# EAGLE design STM_L5970D_1A0 (EAGLE 7.5.0)
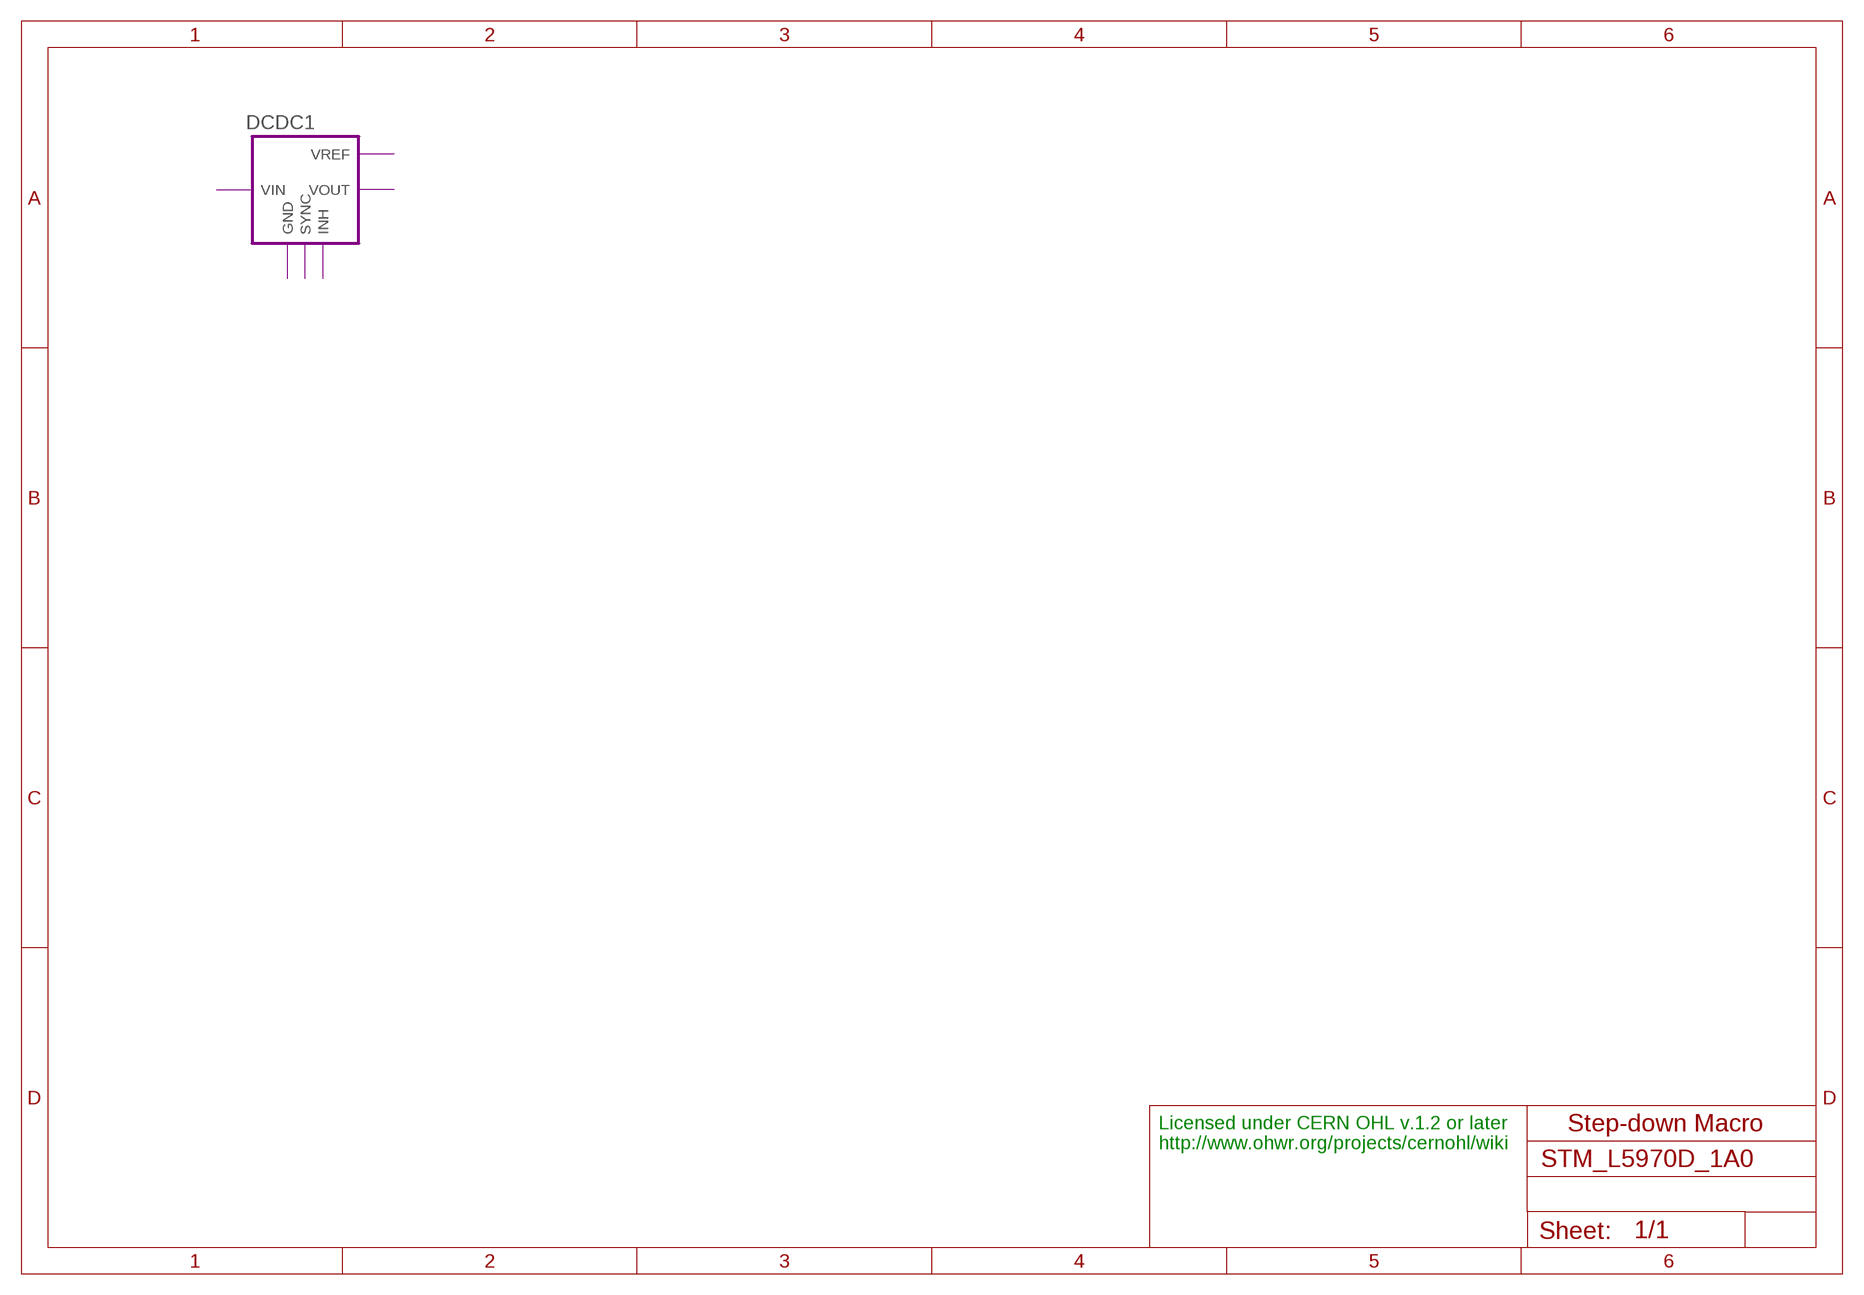
[diagram p0: schematic, sheet 1]

## Module instances
DCDC1 = STM_L5970D_1A0

## Notes on the sheet
- Step-down Macro
- Licensed under CERN OHL v.1.2 or later
  http://www.ohwr.org/projects/cernohl/wiki

## Library data of the parts

## Module STM_L5970D_1A0
Ports: VIN(pwr) GND(pwr) VOUT(out) SYNC(io) VREF(out) INH(io)
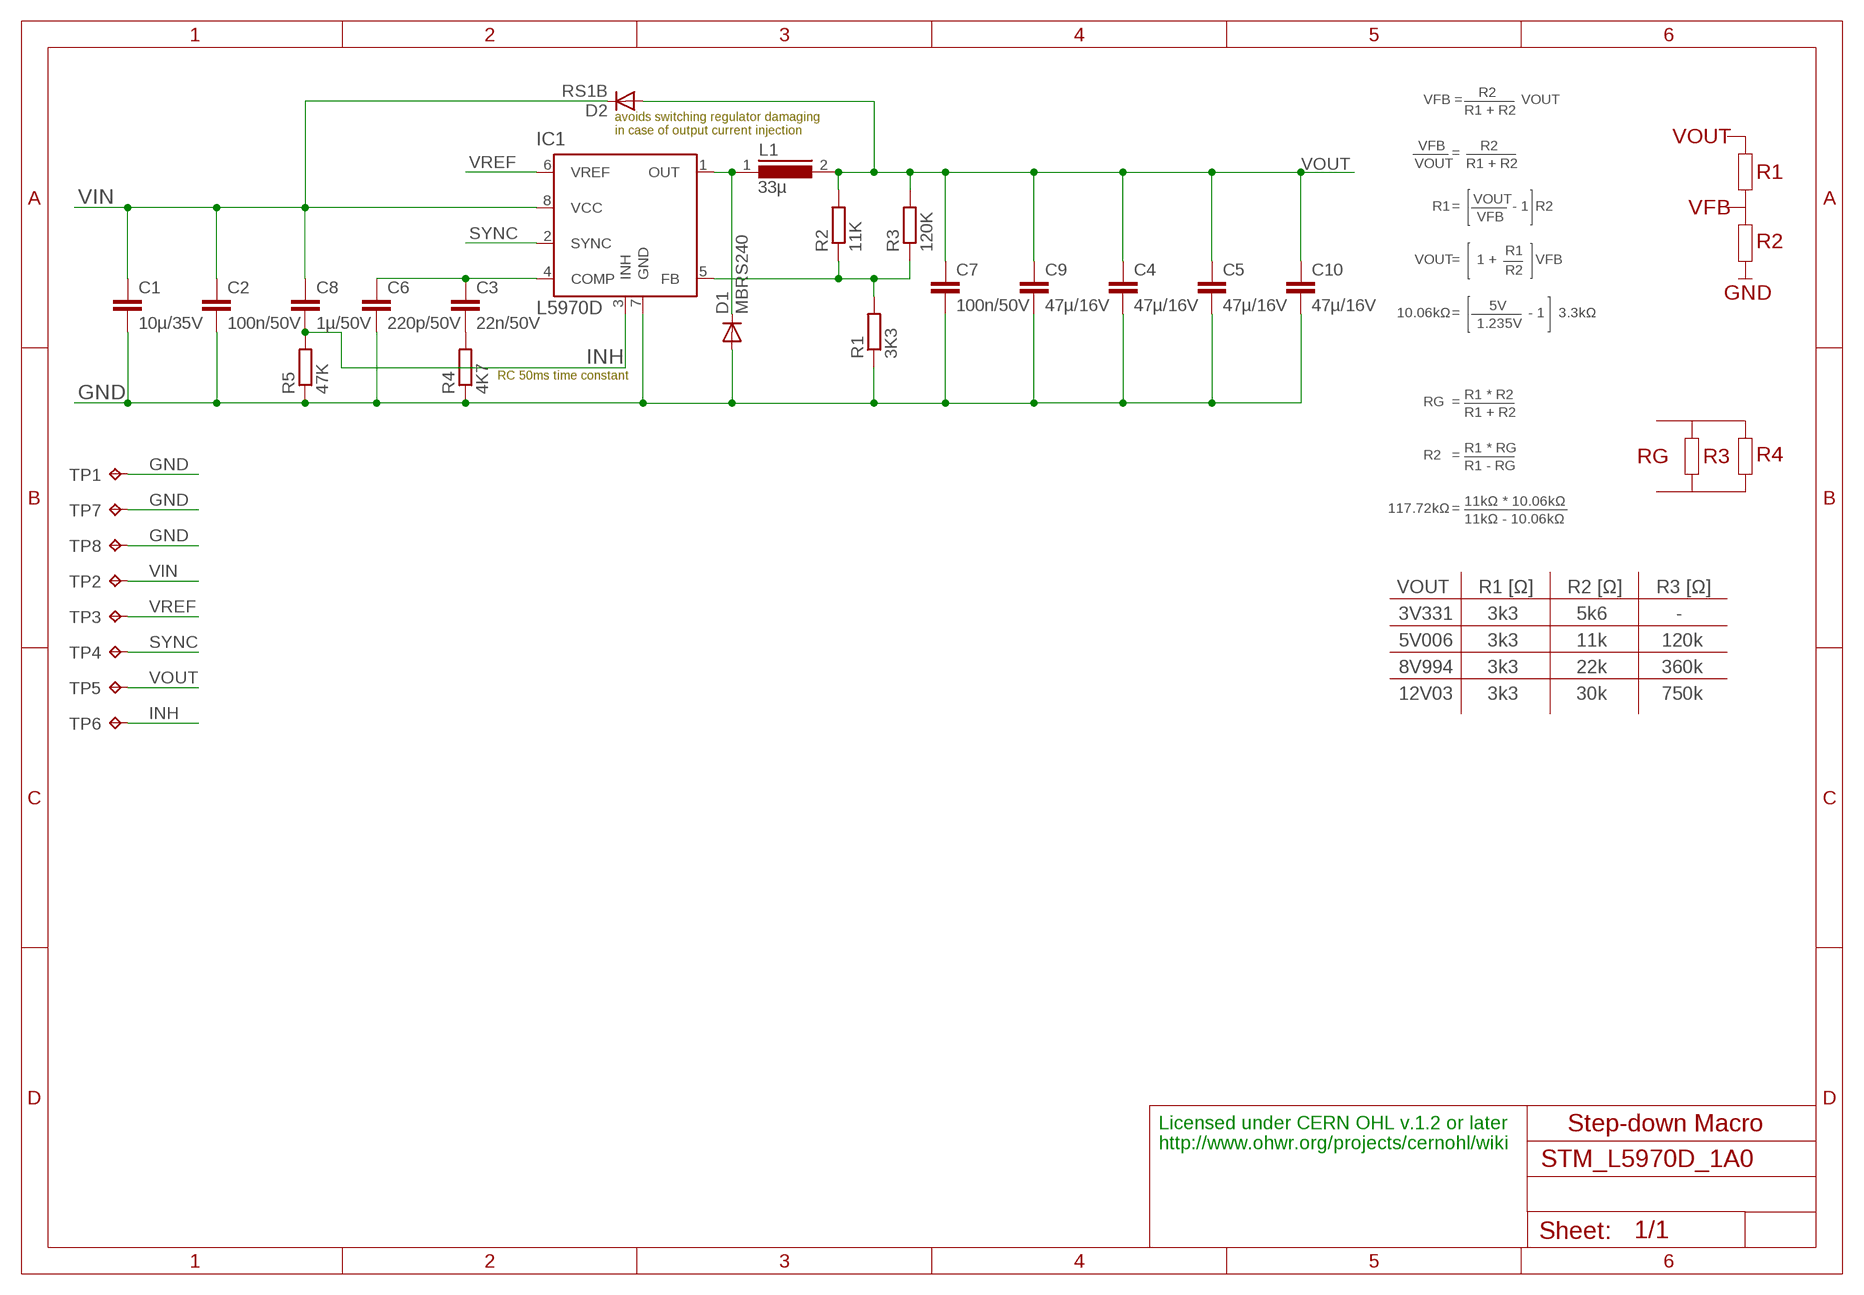
[diagram p1: schematic, module STM_L5970D_1A0, sheet 1]

### Parts
C1  10µ/35V  X7R-10000000P-1210  [1210]
C2  100n/50V  X7R-100000P-1206  [1206]
C3  22n/50V  X7R-22000P-1206  [1206]
C4  47µ/16V  X5R-47000000P-1210  [1210]
C5  47µ/16V  X5R-47000000P-1210  [1210]
C6  220p/50V  NP0-220P-1206  [1206]
C7  100n/50V  X7R-100000P-1206  [1206]
C8  1µ/50V  X7R-1000000P-1206  [1206]
C9  47µ/16V  X5R-47000000P-1210  [1210]
C10  47µ/16V  X5R-47000000P-1210  [1210]
D1  MBRS240  [DO214AA]
D2  RS1B  [DO214AC]
IC1  L5970D  [SOIC08]
L1  33µ  PISM-330X  [PISM]
R1  3K3  RC1206-3300  [1206]
R2  11K  RC1206-11000  [1206]  (variant 3V3: 5K6)  (variant 9V0: 22K)  (variant 12V0: 30K)
R3  120K  RC1206-120000  [1206]  (not fitted in variant 3V3)  (variant 9V0: 360K)  (variant 12V0: 750K)
R4  4K7  RC1206-4700  [1206]
R5  47K  RC1206-47000  [1206]
TP1  TPB1,27  [B1,27]
TP2  TPB1,27  [B1,27]
TP3  TPB1,27  [B1,27]
TP4  TPB1,27  [B1,27]
TP5  TPB1,27  [B1,27]
TP6  TPB1,27  [B1,27]
TP7  TPB1,27  [B1,27]
TP8  TPB1,27  [B1,27]

### Nets
GND: C1.2 C2.2 C4.2 C5.2 C6.2 C7.2 C9.2 C10.2 D1.A IC1.7(GND) R1.1 R4.1 R5.1 TP1.TP TP7.TP TP8.TP
INH: C8.2 IC1.3(INH) R5.2 TP6.TP
N$1: D1.C IC1.1(OUT) L1.1
N$2: IC1.5(FB) R1.2 R2.1 R3.1
N$3: C3.1 C6.1 IC1.4(COMP)
N$4: C3.2 R4.2
SYNC: IC1.2(SYNC) TP4.TP
VIN: C1.1 C2.1 C8.1 D2.C IC1.8(VCC) TP2.TP
VOUT: C4.1 C5.1 C7.1 C9.1 C10.1 D2.A L1.2 R2.2 R3.2 TP5.TP
VREF: IC1.6(VREF) TP3.TP

### Notes on the sheet
- R2
- VFB = | VOUT
- R1 + R2
- avoids switching regulator damaging
  in case of output current injection
- VOUT
- VFB | R2
- =
- VOUT | R1 + R2
- R1
- VOUT
- R1 | = | - 1 | R2 | VFB
- VFB
- R2
- R1
- VOUT | = | 1 + | VFB
- R2
- GND
- 5V
- 10.06kΩ | = | - 1 | 3.3kΩ
- 1.235V
- RC 50ms time constant
- R1 * R2
- RG | =
- R1 + R2
- R1 * RG
- R2 | = | RG | R3 | R4
- R1 - RG
- 11kΩ * 10.06kΩ
- 117.72kΩ | =
- 11kΩ - 10.06kΩ
- VOUT | R1 [Ω] | R2 [Ω] | R3 [Ω]
- 3V331 | 3k3 | 5k6 | -
- 5V006 | 3k3 | 11k | 120k
- 8V994 | 3k3 | 22k | 360k
- 12V03 | 3k3 | 30k | 750k
- Step-down Macro
- Licensed under CERN OHL v.1.2 or later
  http://www.ohwr.org/projects/cernohl/wiki

### Library data of the parts
C1 = omcCapacitor:X7R: X7R Ceramic Capacitors YAGEO Multilayer Capacitors For General Purpose Temperature characteristics: X7R Rated Voltage: 50V Operating Temperature Range: –55°C to +125°C Reichelt Datasheet <http://cdn-reichelt.de/documents/datenblatt/B300/X7R.pdf> MURATA GCM Series High Dielectric Constant Type Murata Datasheet <http://www.murata.com/~/media/webrenewal/support/library/catalog/products/capacitor/mlcc/c03e.ashx> Reichelt Datasheet <http://cdn-reichelt.de/documents/datenblatt/A900/DATASHEET_SMD_0805_1206_1210.pdf>; DIST#REICHELT#: X7R-G1210 10; VENDOR#: MURATA#GCM32EC7YA106KA03
C2 C7 = omcCapacitor:X7R: X7R Ceramic Capacitors YAGEO Multilayer Capacitors For General Purpose Temperature characteristics: X7R Rated Voltage: 50V Operating Temperature Range: –55°C to +125°C Reichelt Datasheet <http://cdn-reichelt.de/documents/datenblatt/B300/X7R.pdf> MURATA GCM Series High Dielectric Constant Type Murata Datasheet <http://www.murata.com/~/media/webrenewal/support/library/catalog/products/capacitor/mlcc/c03e.ashx> Reichelt Datasheet <http://cdn-reichelt.de/documents/datenblatt/A900/DATASHEET_SMD_0805_1206_1210.pdf>; DIST#REICHELT#: X7R-G1206 100N; VENDOR#: YAGEO#12062R104K9BP0D
C3 = omcCapacitor:X7R: X7R Ceramic Capacitors YAGEO Multilayer Capacitors For General Purpose Temperature characteristics: X7R Rated Voltage: 50V Operating Temperature Range: –55°C to +125°C Reichelt Datasheet <http://cdn-reichelt.de/documents/datenblatt/B300/X7R.pdf> MURATA GCM Series High Dielectric Constant Type Murata Datasheet <http://www.murata.com/~/media/webrenewal/support/library/catalog/products/capacitor/mlcc/c03e.ashx> Reichelt Datasheet <http://cdn-reichelt.de/documents/datenblatt/A900/DATASHEET_SMD_0805_1206_1210.pdf>; DIST#REICHELT#: X7R-G1206 22N; VENDOR#: YAGEO#12062R223K9BP0D
C4 C5 C9 C10 = omcCapacitor:X5R: X5R Ceramic Capacitors Murate GRM Series For General Purpose Temperature characteristics: X5R Size: 0.4×0.2mm to 5.7×5.0mm Rated Voltage: DC2.5V to 3.15kV Operating Temperature Range: –55°C to +85°C Product Side <http://psearch.en.murata.com/capacitor/lineup/grm> Murata Datasheet <http://www.murata.com/~/media/webrenewal/support/library/catalog/products/capacitor/mlcc/c02e.ashx> Distributor Reichelt: avialable Conrad: avialable Digi-Key: -; DIST#REICHELT#: X5R-G1210 47; VENDOR#: MURATA,GRM32ER61C476ME15#
C6 = omcCapacitor:NP0: NP0 Surface-Mount Ceramic Multilayer Capacitors YAGEO Multilayer Capacitors For General Purpose RoHS compliant Rated Voltage: 50V Operating Temperature Range: –55°C to +125°C Yageo Datasheet <http://www.yageo.com/documents/recent/UPY-GP_NP0_16V-to-50V_8.pdf> Distributor Reichelt: avialable Conrad: avialable Digi-Key: -; DIST#REICHELT#: NPO-G1206 220P; VENDOR#: YAGEO#1206CG221J9BP
C8 = omcCapacitor:X7R: X7R Ceramic Capacitors YAGEO Multilayer Capacitors For General Purpose Temperature characteristics: X7R Rated Voltage: 50V Operating Temperature Range: –55°C to +125°C Reichelt Datasheet <http://cdn-reichelt.de/documents/datenblatt/B300/X7R.pdf> MURATA GCM Series High Dielectric Constant Type Murata Datasheet <http://www.murata.com/~/media/webrenewal/support/library/catalog/products/capacitor/mlcc/c03e.ashx> Reichelt Datasheet <http://cdn-reichelt.de/documents/datenblatt/A900/DATASHEET_SMD_0805_1206_1210.pdf>; DIST#REICHELT#: X7R-G1206 1,0/50; VENDOR#: MURATA#GCM31MR71H105KA55
D1 = omcDiode:MBRS2: MBRS2X0 - 2A Schottky Power Rectifier Schottky barrier rectifiers 2A 40V SMB 403A-03 (DO213AB) Package Fairchild MBRS320 Datasheet <https://www.fairchildsemi.com/datasheets/MB/MBRS320.pdf> Reichelt Datasheet <http://cdn-reichelt.de/documents/datenblatt/A400/MBRS240SMD_ONS.pdf> Characteristics MBRS240 Unit Peak Repetitive Reverse Voltage 40 V Average Rectified Forward Current 2.0 @100°C A Nonrepetitive Peak Surge Current 25 A Operating Junction Temperature – 55 to +150 °C Thermal Resistance — Junction to Lead 18 °C/W Maximum Instantaneous Forward Voltage (IF = 3.0 A, TJ = 25°C)) 0.43 V Maximum Instantaneous Reverse Current Rated dc Voltage, TJ = 25°C Rated dc Voltage, TJ = 100°C 2.0 60 mA Distributor Reichelt: avialable Conrad: ? Digi-Key: ?; DIST#REICHELT#: MBRS 240 SMD; VENDOR#: On Semiconductor,MBRS240LT3G
D2 = omcDiode:RS1: RS1X - PN Diode For surface mounted application Glass passivated junction chip Built-in strain relief, ideal for automated placement Fast switching for high efficiency Plastic material used carries Underwriters Laboratory Classification 94V-O High temperature soldering: 260°C/10sec at terminals Taiwan Semiconductor Datasheet <http://www.taiwansemi.com/products/datasheet/RS1A%20SERIES_K15.pdf> Reichelt Datasheet <http://cdn-reichelt.de/documents/datenblatt/A400/RS1-TSC.pdf> Maximum Ratings and Electrical Characteristics Type Number Symbol RS1A RS1B RS1D RS1G RS1J RS1K RS1M Unit Maximum Repetitive Peak Reverse Voltage VRRM 50 100 200 400 600 800 100 V Maximum RMS Voltage VRMS 35 70 140 280 420 560 700 V Maximum DC Blocking Voltage VDC 50 100 200 400 600 800 1000 V Maximum Average Forward Rectified Current .375 (9.5mm) Lead Length @ TL=90℃ IF(AV) 1 A Peak Forward Surge Current, 8.3 ms Single Half Sine- waveSuperimposed on Rated Load (JEDEC method) IFSM 30 A Maximum Instantaneous Forward Voltage @ 1A VF 1.3 V Maximum Reverse Current @ Rated VR TA=25 ℃ TA=125 ℃ IR 5 50 µA Maximum Reverse Recovery Time Trr 150 250 500 nS Typical Junction Capacitance Cj 10 pF Typical Thermal Resistance RθjA RθjC 105 32 °C/W Operating Temperature Range TJ -55 to +150 °C Storage Temperature Range TSTG -55 to +150 °C Distributor Reichelt: avialable Conrad: avialable Digi-Key: -; DIST#REICHET#: RS 1B; VENDOR#: Taiwan Semiconductor,RS1BHR3G
IC1 = omcPwrSupply:L5970D: STMicroelectronics - L5970D - Up to 1A step down switching regulator Up to 1A output current Operating input voltage from 4.4V to 36V 3.3V / (±2%) reference voltage Output voltage adjustable from 1.2V to 35V Low dropout operation: 100% duty cycle 250KHz Internally fixed frequency Voltage feedforward Zero load current operation Internal current limiting Inhibit for zero current consumption Synchronization Protection against feedback disconnection Thermal shutdown STM Datasheet <http://www.st.com/web/en/resource/technical/document/datasheet/CD00002173.pdf> Reichelt Datasheet <http://cdn-reichelt.de/documents/datenblatt/A200/DS_5970D.pdf>; DIST#CONRAD#: 1185187 - 62; DIST#REICHELT#: L 5970 D; VENDOR#: STM,L5970D013TR
L1 = omcInductor:PISM: PISM - SMD Power Inductors Inductance: 1µH - 2200µH Current: 0.25A - 10A Mounting: SMD Material: Ferrite Dimension: L: 13mm W: 9.55mm H: 5.35mm Fastron Datasheet <http://www.fastrongroup.com/image-show/56/PISM.pdf?type=Complete-DataSheet&productType=series> Reichelt Datasheet <http://cdn-reichelt.de/documents/datenblatt/B400/PISM.pdf> Inductance L [µH] fL [MHz] SRFmin [MHz] DCRmax [Ω] Rated DC Current [A] Isat IΔT 1.0 0.1 115 0.008 10 6.9 1.5 0.1 90 0.009 9 6.5 2.2 0.1 80 0.010 8 6.2 3.3 0.1 58 0.014 7 5.5 4.7 0.1 49 0.017 6 4.9 6.8 0.1 39 0.022 5.1 4.4 10 0.1 28 0.036 4.2 3.9 15 0.1 22 0.050 3.2 3.2 22 0.1 17 0.060 2.7 2.7 33 0.1 13 0.100 2.1 2.1 47 0.1 10 0.140 1.7 1.7 68 0.1 8.5 0.190 1.5 1.5 100 0.1 7.0 0.280 1.2 1.2 150 0.1 5.3 0.420 1.0 1.0 220 0.1 4.1 0.600 0.85 0.85 330 0.1 3.2 0.900 0.65 0.65 470 0.1 2.8 1.250 0.55 0.55 680 0.1 2.3 2.00 0.45 0.45 1000 0.1 1.7 2.70 0.35 0.35 2200 0.1 1.4 7.00 0.25 0.22 Distributor Reichelt: L-PISM XXµ Conrad: avialable Digi-Key: -; DIST#REICHELT#: L-PISM 33µ; VENDOR#: Fastron,PISM-330X-04
R1 = omcResistor:RC1206: YAGEO RC1206 - General Purpose Chip Resistors Power dissipation: 0.250W 1% Tolerance E96 Series Operating Temperature Range: –55°C to +155°C Maximum Working Voltage: 200V Maximum Overload Voltage: 400V Temperature Coefficient: 10Ω< R≤10MΩ: ±100 ppm/°C R≤10Ω || R>10 MΩ: ±200 ppm/°C Jumper Criteria Rated Current: 2A Maximum Current: 10A Yageo Datasheet <http://www.yageo.ru/pdf/RC1206.pdf> Reichelt Datasheet <http://cdn-reichelt.de/documents/datenblatt/A900/SMD_1206.pdf> Distributor Reichelt: E24 Conrad: avialable Digi-Key: -; DIST#REICHELT#: SMD 1/4W 3,3K; VENDOR#: YAGEO#RC1206FR-073K3L
R2 = omcResistor:RC1206: YAGEO RC1206 - General Purpose Chip Resistors Power dissipation: 0.250W 1% Tolerance E96 Series Operating Temperature Range: –55°C to +155°C Maximum Working Voltage: 200V Maximum Overload Voltage: 400V Temperature Coefficient: 10Ω< R≤10MΩ: ±100 ppm/°C R≤10Ω || R>10 MΩ: ±200 ppm/°C Jumper Criteria Rated Current: 2A Maximum Current: 10A Yageo Datasheet <http://www.yageo.ru/pdf/RC1206.pdf> Reichelt Datasheet <http://cdn-reichelt.de/documents/datenblatt/A900/SMD_1206.pdf> Distributor Reichelt: E24 Conrad: avialable Digi-Key: -; DIST#REICHELT#: SMD 1/4W 11K; VENDOR#: YAGEO#RC1206FR-0711KL
R3 = omcResistor:RC1206: YAGEO RC1206 - General Purpose Chip Resistors Power dissipation: 0.250W 1% Tolerance E96 Series Operating Temperature Range: –55°C to +155°C Maximum Working Voltage: 200V Maximum Overload Voltage: 400V Temperature Coefficient: 10Ω< R≤10MΩ: ±100 ppm/°C R≤10Ω || R>10 MΩ: ±200 ppm/°C Jumper Criteria Rated Current: 2A Maximum Current: 10A Yageo Datasheet <http://www.yageo.ru/pdf/RC1206.pdf> Reichelt Datasheet <http://cdn-reichelt.de/documents/datenblatt/A900/SMD_1206.pdf> Distributor Reichelt: E24 Conrad: avialable Digi-Key: -; DIST#REICHELT#: SMD 1/4W 120K; VENDOR#: YAGEO#RC1206FR-07120KL
R4 = omcResistor:RC1206: YAGEO RC1206 - General Purpose Chip Resistors Power dissipation: 0.250W 1% Tolerance E96 Series Operating Temperature Range: –55°C to +155°C Maximum Working Voltage: 200V Maximum Overload Voltage: 400V Temperature Coefficient: 10Ω< R≤10MΩ: ±100 ppm/°C R≤10Ω || R>10 MΩ: ±200 ppm/°C Jumper Criteria Rated Current: 2A Maximum Current: 10A Yageo Datasheet <http://www.yageo.ru/pdf/RC1206.pdf> Reichelt Datasheet <http://cdn-reichelt.de/documents/datenblatt/A900/SMD_1206.pdf> Distributor Reichelt: E24 Conrad: avialable Digi-Key: -; DIST#REICHELT#: SMD 1/4W 4,7K; VENDOR#: YAGEO#RC1206FR-074K7L
R5 = omcResistor:RC1206: YAGEO RC1206 - General Purpose Chip Resistors Power dissipation: 0.250W 1% Tolerance E96 Series Operating Temperature Range: –55°C to +155°C Maximum Working Voltage: 200V Maximum Overload Voltage: 400V Temperature Coefficient: 10Ω< R≤10MΩ: ±100 ppm/°C R≤10Ω || R>10 MΩ: ±200 ppm/°C Jumper Criteria Rated Current: 2A Maximum Current: 10A Yageo Datasheet <http://www.yageo.ru/pdf/RC1206.pdf> Reichelt Datasheet <http://cdn-reichelt.de/documents/datenblatt/A900/SMD_1206.pdf> Distributor Reichelt: E24 Conrad: avialable Digi-Key: -; DIST#REICHELT#: SMD 1/4W 47K; VENDOR#: YAGEO#RC1206FR-0747KL
TP1 TP7 TP8 = testpad:TP: Test pad; TP_SIGNAL_NAME: GND
TP2 = testpad:TP: Test pad; TP_SIGNAL_NAME: VIN
TP3 = testpad:TP: Test pad; TP_SIGNAL_NAME: VREF
TP4 = testpad:TP: Test pad; TP_SIGNAL_NAME: SYNC
TP5 = testpad:TP: Test pad; TP_SIGNAL_NAME: VOUT
TP6 = testpad:TP: Test pad; TP_SIGNAL_NAME: INH

## Board
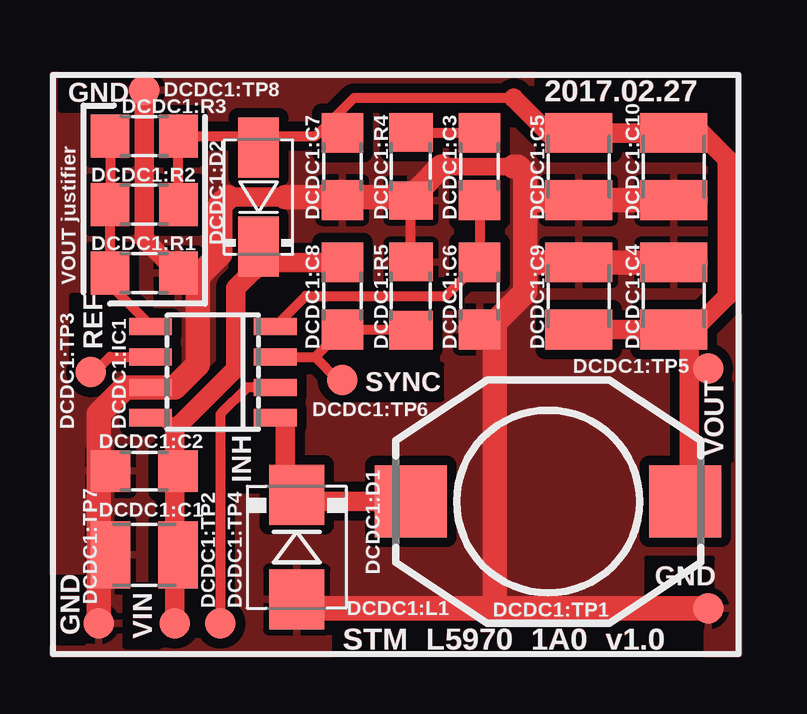
[diagram p2: board, top side]

No outline drawn. Coordinates in mm, seen from the top.
Copper layers (1*16): Top 0.035mm / dielectric 1.5mm / Bottom 0.035mm
Design rules "aisler_go": minimum track width 0.07mm, minimum drill 0.2mm, track to track 0.07mm, track to pad 0.07mm, pad to pad 0.07mm, via to via 0.07mm, smd to smd 0.07mm, copper to edge 0.2mm, drill to drill 0.21mm, minimum pad ring 0.25mm, minimum via ring 0.05mm, stop-mask expansion 0.05mm, vias tented up to drill 0mil, thermal gap 10mil

### Footprints (pad centres in the part's own frame; a part is rotated, then mirrored left to right if it is on the bottom)
1210 = smd 1.651 x 2.794: 1 -1.4,0; 2 1.4,0
1206 = smd 1.651 x 1.727: 1 -1.4,0; 2 1.4,0
DO214AA = smd 2.5 x 2.3: A 2.175,0; C -2.175,0
DO214AC = smd 2.5 x 1.7: A 2.064,0; C -2.064,0
SOIC08 = smd 1.78 x 0.72: 1 -2.6,1.905; 2 -2.6,0.635; 3 -2.6,-0.635; 4 -2.6,-1.905; 5 2.6,-1.905; 6 2.6,-0.635; 7 2.6,0.635; 8 2.6,1.905
PISM = smd 3 x 3: 1 -5.715,0; 2 5.715,0
1206' = smd 1.6 x 1.803: 1 -1.422,0; 2 1.422,0
B1,27 = smd 1.27 x 1.27: TP 0,0

### Placement (x,y rotation side)
DCDC1:C1  10µ/35V  [1210]  3.81,4.13 180 top
DCDC1:C2  100n/50V  [1206]  3.81,7.62 180 top
DCDC1:C3  22n/50V  [1206]  17.78,20.32 90 top
DCDC1:C4  47µ/16V  [1210]  25.88,14.92 90 top
DCDC1:C5  47µ/16V  [1210]  21.91,20.32 270 top
DCDC1:C6  220p/50V  [1206]  17.78,14.92 270 top
DCDC1:C7  100n/50V  [1206]  12.06,20.32 270 top
DCDC1:C8  1µ/50V  [1206]  12.06,14.92 270 top
DCDC1:C9  47µ/16V  [1210]  21.91,14.92 90 top
DCDC1:C10  47µ/16V  [1210]  25.88,20.32 270 top
DCDC1:D1  MBRS240  [DO214AA]  10.16,4.45 270 top
DCDC1:D2  RS1B  [DO214AC]  8.57,19.05 90 top
DCDC1:IC1  L5970D  [SOIC08]  6.67,11.75 180 top
DCDC1:L1  33µ  [PISM]  20.64,6.35 0 top
DCDC1:R1  3K3  [1206']  3.81,15.88 180 top
DCDC1:R2  11K  [1206']  3.81,18.73 0 top
DCDC1:R3  120K  [1206']  3.81,21.59 0 top
DCDC1:R4  4K7  [1206']  14.92,20.32 90 top
DCDC1:R5  47K  [1206']  14.92,14.92 270 top
DCDC1:TP1  TPB1,27  [B1,27]  27.3,1.91 0 top
DCDC1:TP2  TPB1,27  [B1,27]  5.08,1.27 0 top
DCDC1:TP3  TPB1,27  [B1,27]  1.59,11.75 0 top
DCDC1:TP4  TPB1,27  [B1,27]  6.99,1.27 0 top
DCDC1:TP5  TPB1,27  [B1,27]  27.3,11.91 0 top
DCDC1:TP6  TPB1,27  [B1,27]  12.06,11.43 0 top
DCDC1:TP7  TPB1,27  [B1,27]  1.91,1.27 0 top
DCDC1:TP8  TPB1,27  [B1,27]  3.81,23.5 0 top

### Tracks (layer width: path | path; a pad name or v marks a point on that pad's centre or on a via)
DCDC1:GND
  Top 0.406: DCDC1:R1.1 6.03,15.88 | 12.06,18.89 DCDC1:C7.2 12.06,19.05 | 19.68,16.19 19.53,16.34 19.51,16.32 | DCDC1:R5.1 DCDC1:R4.1 14.92,19.05 | DCDC1:C6.2 18.39,13.52 18.41,13.49 | DCDC1:C2.2 1.91,7.62 | DCDC1:C1.2 2.06,4.13 1.91,3.97
  Top 0.737: 16.19,20.32 19.21,20.32
  Top 0.813: 7.3,19.05 9.68,19.05 | DCDC1:TP8.TP 3.81,17.3 DCDC1:R1.1
  Top 1.016: 19.21,20.32 19.37,20.32 19.68,20 19.68,18.89 | 19.68,16.19 19.68,18.89 | DCDC1:C4.2 DCDC1:C9.2 19.82,16.32 19.68,16.19 | DCDC1:C10.2 DCDC1:C5.2 19.71,18.92 19.68,18.89 | 9.68,19.05 12.06,19.05 14.92,19.05 15.24,19.05 15.24,19.37 16.19,20.32 | 7.3,19.05 6.99,18.73 6.99,16.67 6.19,15.88 6.03,15.88 6.03,12.06 5.08,11.11 DCDC1:IC1.7 3.02,11.11 1.91,10 1.91,7.62 1.91,3.97 DCDC1:TP7.TP | DCDC1:TP1.TP 18.41,1.91 | 18.41,1.91 10.53,1.91 DCDC1:D1.A | 18.41,1.91 18.41,13.49 18.41,13.81 19.68,15.08 19.68,16.19
  pour Top (isolate 0.406): 0,24.13 0,0 28.57,0 28.57,24.13
DCDC1:INH
  Top 0.406: DCDC1:C8.2 14.9,13.52 DCDC1:R5.2 | 12.04,13.49 DCDC1:C8.2 | 10.93,12.38 DCDC1:C8.2 | DCDC1:TP6.TP 11.88,11.43 10.93,12.38 | DCDC1:IC1.3 10.93,12.38
DCDC1:N$1
  Top 0.61: DCDC1:D1.C 9.79,6.62 10.16,6.99 | DCDC1:IC1.1 9.68,9.84 9.68,9.68
  Top 0.813: DCDC1:L1.1 10.43,6.35 DCDC1:D1.C 9.68,7.1 9.68,9.68 | 10.16,6.99 10.16,7.3
DCDC1:N$2
  Top 0.406: DCDC1:R3.1 DCDC1:R2.1 DCDC1:R1.2 2.38,15.87 2.38,15.4 4.07,13.71 DCDC1:IC1.5
DCDC1:N$3
  Top 0.406: 16.38,14.92 10.54,14.92 DCDC1:IC1.4 | 16.35,14.95 16.38,14.92 | 16.38,14.92 DCDC1:C6.1 DCDC1:C3.1
DCDC1:N$4
  Top 0.406: DCDC1:C3.2 14.94,21.72 DCDC1:R4.2
DCDC1:SYNC
  Top 0.406: DCDC1:TP4.TP 6.99,10 8.1,11.11 DCDC1:IC1.2
DCDC1:VIN
  Top 0.406: 9.18,16.32 8.95,16.58 DCDC1:D2.C | DCDC1:C2.1 5.08,7.62 | DCDC1:C1.1 5.21,4.1 5.08,3.97
  Top 0.61: DCDC1:IC1.8 4.6,9.84 5.08,9.37
  Top 0.813: 8.95,16.58 7.62,15.25 7.62,11.91 5.08,9.37 5.08,7.62 5.08,3.97 DCDC1:TP2.TP | DCDC1:C8.1 9.18,16.32
DCDC1:VOUT
  Top 0.406: 5.36,21.72 DCDC1:R3.2 | DCDC1:R2.2 DCDC1:R3.2 | 19.21,23.18 12.54,23.18 11.75,22.38 | DCDC1:R3.2 8.73,21.59 | 8.73,21.59 10.95,21.59 11.75,22.38 | DCDC1:C7.1 12.06,22.07 11.75,22.38 | DCDC1:D2.A 8.57,21.43 8.73,21.59 | 26.51,13.34 26.06,13.34
  Top 0.813: 25.91,13.49 DCDC1:C4.1 | 26.06,13.34 DCDC1:C4.1 | 19.21,23.18 20.67,21.72 DCDC1:C5.1 DCDC1:C10.1 25.91,21.75 26.99,21.75 28.1,20.64 28.1,14.92 26.51,13.34 26.51,11.91 | 26.51,11.91 26.51,6.51 DCDC1:L1.2 | DCDC1:C9.1 DCDC1:C4.1 | DCDC1:TP5.TP 26.51,11.91
DCDC1:VREF
  Top 0.406: DCDC1:TP3.TP 1.75,11.75 2.38,12.38 DCDC1:IC1.6
N$1
  cutout Top: 11.75,1.27 11.75,0 26.99,0 26.99,1.27
N$2
  cutout Top: 24.77,3.97 24.77,2.54 27.46,2.54 27.46,3.97
N$3
  cutout Top: 26.83,11.27 26.83,8.1 28.26,8.1 28.26,11.27
N$4
  cutout Top: 20.32,24.13 20.32,22.7 28.26,22.7 28.26,24.13
N$5
  cutout Top: 0.32,23.97 0.32,22.7 3.02,22.7 3.02,23.97
N$6
  cutout Top: 0.79,14.92 0.79,12.38 2.54,12.38 2.54,14.92
N$7
  cutout Top: 0,3.17 0,0.48 1.27,0.48 1.27,3.17
N$8
  cutout Top: 3.02,2.86 3.02,0.32 4.45,0.32 4.45,2.86
N$9
  cutout Top: 7.14,9.37 7.14,6.83 8.57,6.83 8.57,9.37
N$10
  cutout Top: 12.7,12.06 12.7,10.64 16.19,10.64 16.19,12.06

### Text on the board
Top: GND | 2017.02.27 | REF | SYNC | VOUT | INH | GND | GND | VIN | STM_L5970_1A0_v1.0
tPlace: GND | 2017.02.27 | VOUT justifier | REF | SYNC | VOUT | INH | GND | GND | VIN | STM_L5970_1A0_v1.0